# EAGLE design Forest-Joystick-Mouse-Hub (EAGLE 9.6.2)
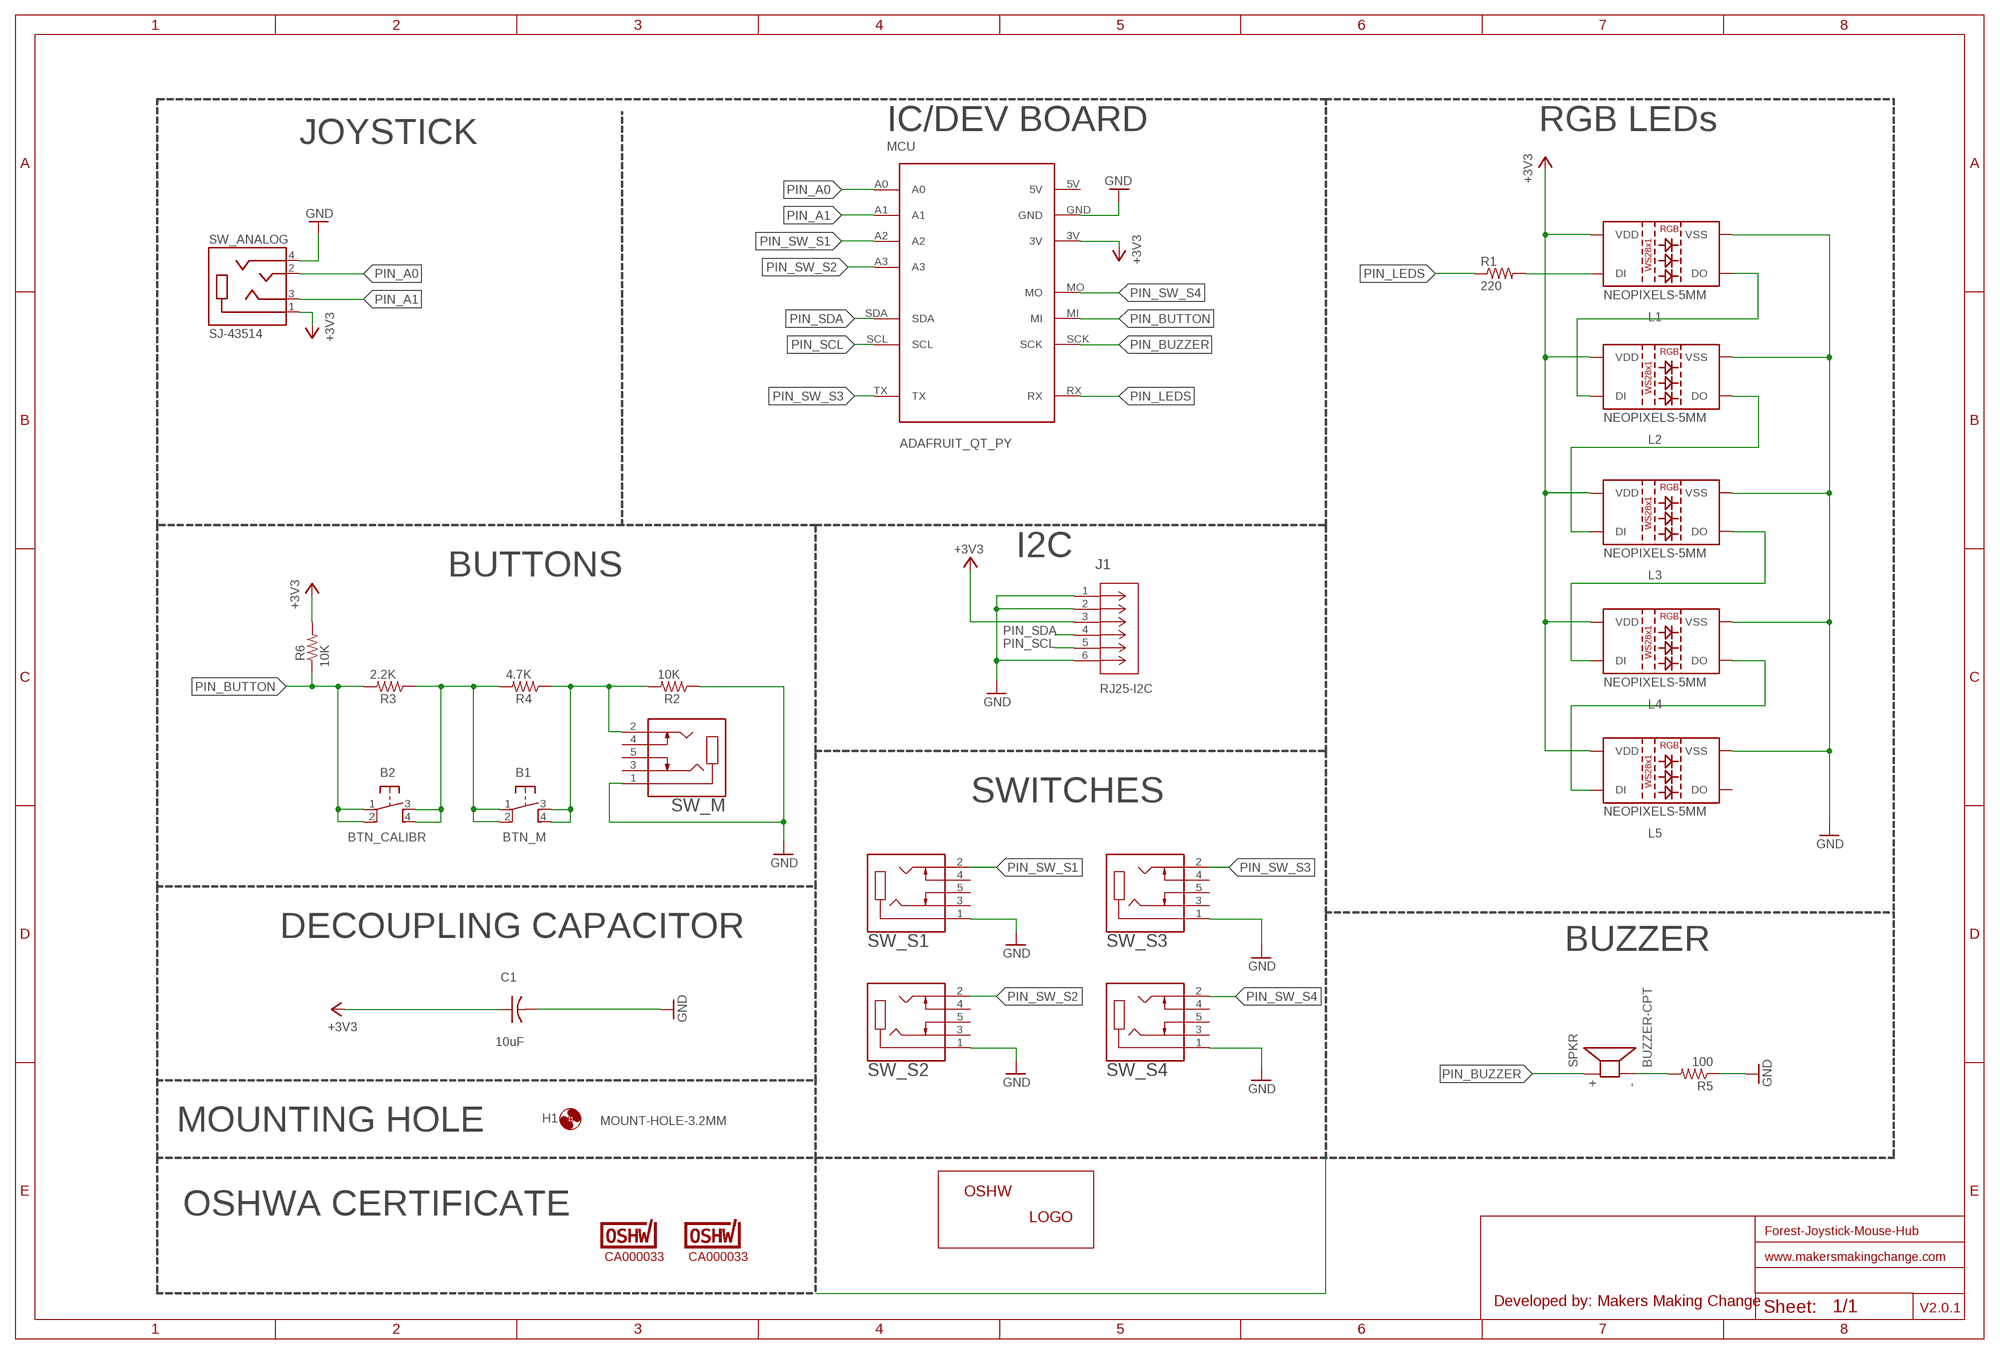
[diagram p0: schematic, sheet 1]

## Parts
B1  BTN_M  SWITCH_OMRON-PTH-12  [B3F-5050]
B2  BTN_CALIBR  SWITCH_OMRON-PTH-12  [B3F-5050]
C1  10uF  CAPACITOR-US-050-030X075  [CAP-050-030X075]
H1  MOUNT-HOLE-3.2MM  [HOLE-3.2MM]
J1  5555165-1  [CONN6_5555165-1]
L1  NEOPIXELS-5MM  [NEOPIXELS-5MM]
L2  NEOPIXELS-5MM  [NEOPIXELS-5MM]
L3  NEOPIXELS-5MM  [NEOPIXELS-5MM]
L4  NEOPIXELS-5MM  [NEOPIXELS-5MM]
L5  NEOPIXELS-5MM  [NEOPIXELS-5MM]
LOGO-OSHWA  CA000033  OSHWA-LOGO-SMALL  [OSHWA-CERT-SMALL-SILK]
MCU  ADAFRUIT_QT_PY  [QT_PY]
R1  220  RESISTOR-US-0206/8  [RESISTOR_0206/8]
R2  10K  RESISTOR-US-0206/8  [RESISTOR_0206/8]
R3  2.2K  RESISTOR-US-0206/8  [RESISTOR_0206/8]
R4  4.7K  RESISTOR-US-0206/8  [RESISTOR_0206/8]
R5  100  RESISTOR-US-0206/8  [RESISTOR_0206/8]
R6  10K  RESISTOR-US-0206/8  [RESISTOR_0206/8]
SPKR  BUZZER-CPT  [CUI_CPT-1255C-090]
SW_ANALOG  SJ-43514  [CUI_SJ-43514]
SW_M  CUI_SJ1-3535NGSJ1-3535NG  [CUI_SJ1-3535NG]
SW_S1  CUI_SJ1-3535NGSJ1-3535NG  [CUI_SJ1-3535NG]
SW_S2  CUI_SJ1-3535NGSJ1-3535NG  [CUI_SJ1-3535NG]
SW_S3  CUI_SJ1-3535NGSJ1-3535NG  [CUI_SJ1-3535NG]
SW_S4  CUI_SJ1-3535NGSJ1-3535NG  [CUI_SJ1-3535NG]
U$3  OSHW_LOGO-XSM  [OSHW_X-SMALL_LOGO]
U$4  CA000033  OSHWA-LOGO-SMALL  [OSHWA-CERT-SMALL-SILK]

## Nets
+3V3: C1.1 J1.3 L1.P2(VDD) L2.P2(VDD) L3.P2(VDD) L4.P2(VDD) L5.P2(VDD) MCU.3V R6.2 SW_ANALOG.1(SLEEVE)
GND: C1.2 J1.1 J1.2 J1.6 L1.P3(VSS) L2.P3(VSS) L3.P3(VSS) L4.P3(VSS) L5.P3(VSS) MCU.GND R2.1 R5.1 SW_ANALOG.4(RING2) SW_M.1 SW_S1.1 SW_S2.1 SW_S3.1 SW_S4.1
N$1: B1.1 B1.2 B2.3 B2.4 R3.1 R4.2
N$3: L1.P4(DO) L2.P1(DI)
N$5: B1.3 B1.4 R2.2 R4.1 SW_M.2
N$6: L2.P4(DO) L3.P1(DI)
N$7: L3.P4(DO) L4.P1(DI)
N$9: L4.P4(DO) L5.P1(DI)
N$10: L1.P1(DI) R1.2
N$12: R5.2 SPKR.N
PIN_A0: MCU.A0 SW_ANALOG.2(TIP)
PIN_A1: MCU.A1 SW_ANALOG.3(RING1)
PIN_BUTTON: B2.1 B2.2 MCU.MI R3.2 R6.1
PIN_BUZZER: MCU.SCK SPKR.P
PIN_LEDS: MCU.RX R1.1
PIN_SCL: J1.5 MCU.SCL
PIN_SDA: J1.4 MCU.SDA
PIN_SW_S1: MCU.A2 SW_S1.2
PIN_SW_S2: MCU.A3 SW_S2.2
PIN_SW_S3: MCU.TX SW_S3.2
PIN_SW_S4: MCU.MO SW_S4.2
Unconnected: L5.P4(DO) MCU.5V SW_M.3 SW_M.4 SW_M.5 SW_S1.3 SW_S1.4 SW_S1.5 SW_S2.3 SW_S2.4 SW_S2.5 SW_S3.3 SW_S3.4 SW_S3.5 SW_S4.3 SW_S4.4 SW_S4.5

## Notes on the sheet
- IC/DEV BOARD | RGB LEDs
- JOYSTICK
- I2C
- BUTTONS
- SWITCHES
- DECOUPLING CAPACITOR
- BUZZER
- MOUNTING HOLE
- OSHWA CERTIFICATE
- www.makersmakingchange.com
- Developed by: Makers Making Change
- V2.0.1

## Library data of the parts
B1 B2 = MMC Eagle:SWITCH_OMRON: OMRON SWITCH Now with beefier pads!
C1 = MMC Eagle:CAPACITOR-US-
H1 = MMC Eagle:MOUNT-HOLE-: MOUNTING HOLE with drill center marker
J1 = MMC Eagle:5555165-1; COPYRIGHT: Copyright (C) 2023 Ultra Librarian. All rights reserved.; LABEL: RJ25-I2C; MANUFACTURER_PART_NUMBER: 5555165-1; MFR_NAME: TE Connectivity
L1-L5 = MMC Eagle:NEOPIXELS-5MM: NeoPixel Diffused 5mm Through-Hole LED Addressable Lighting series 5 LED Discrete Serial (Shift Register) Red, Green, Blue (RGB) 5.00mm Dia. Options: Digikey - 1568-1213-ND <https://www.digikey.ca/en/products/detail/sparkfun-electronics/COM-12986/5673799> Mouser - 474-COM-12986 <https://www.mouser.ca/ProductDetail/SparkFun/COM-12986?qs=%2Fha2pyFadujF6KKYCR11tN6uoNPGeiRJUEZeJp5GtyQ%3D>
LOGO-OSHWA U$4 = MMC Eagle:OSHWA-LOGO
MCU = MMC Eagle:ADAFRUIT_QT_PY
R1-R6 = MMC Eagle:RESISTOR-US-: RESISTOR, American symbol
SPKR = MMC Eagle:BUZZER: Buzzer Small round buzzers that operate around the audible 2kHz range. You can use these as speakers to create simple music or user interfaces. Options: PTH - Mini Speaker - PC Mount 12mm 2.048kHz <https://www.sparkfun.com/products/7950> PTH_KIT - Mini Speaker - PC Mount 12mm 2.048kHz <https://www.sparkfun.com/products/7950> KIT simplifies soldering by adding stop mask to one side of the pads. PTH_NO_SILK - Mini Speaker - PC Mount 12mm 2.048kHz <https://www.sparkfun.com/products/7950> No silkscreen indicator of buzzer outline. PTH_KIT_NO_SILK - Mini Speaker - PC Mount 12mm 2.048kHz <https://www.sparkfun.com/products/7950> KIT package w/o silkscreen SMD - Buzzer Audio Magnetic (CCV-084B16) SMD buzzer used on, e.g. the LilyPad Buzzer <https://www.sparkfun.com/products/8463> and RFID USB Reader <https://www.sparkfun.com/products/9963>. SMD_KIT - Buzzer Audio Magnetic (CCV-084B16) SMD Buzzer with elongated pins to make soldering easier. Used on the SparkFun Simon Says - Surface Mount Soldering Kit <https://www.sparkfun.com/products/10935>.
SW_ANALOG = MMC Eagle:SJ-43514: SJ-43514 3.50mm (0.141", 1/8", Mini Plug) - Headphone Phone Jack Stereo (4 Conductor, TRRS) Connector. You can use these as jacks to connect analog joysticks or create simple switch interfaces. Options: Digikey - CP-43514-ND <https://www.digikey.ca/en/products/detail/cui-devices/SJ-43514/368146> Mouser - 490-SJ-43514 <https://www.mouser.ca/ProductDetail/CUI-Devices/SJ-43514?qs=WyjlAZoYn51bsBOfuwwiuw%3D%3D>
SW_M SW_S1-SW_S4 = MMC Eagle:CUI_SJ1-3535NG: SJ1-3535NG 3.50mm (0.141", 1/8", Mini Plug) - Headphone Phone Jack Stereo (3 Conductor, TRS) Connector. You can use these as jacks to create simple switch interfaces. Options: Digikey - CP1-3535NG-ND <https://www.digikey.ca/en/products/detail/cui-devices/SJ1-3535NG/738699> Mouser - 490-SJ1-3535NG <https://www.mouser.ca/ProductDetail/CUI-Devices/SJ1-3535NG?qs=WyjlAZoYn50jUmKVsqeRJw%3D%3D>
U$3 = MMC Eagle:OSHW_LOGO-

## Net classes
0 GND: clearance 0.205 mm
2 GND2: clearance 0.205 mm to class 0, clearance 0.205 mm to class 1, clearance 0.205 mm
3 GND3: clearance 0.205 mm to class 0, clearance 0.205 mm to class 1, clearance 0.205 mm to class 2, clearance 0.205 mm

## Board
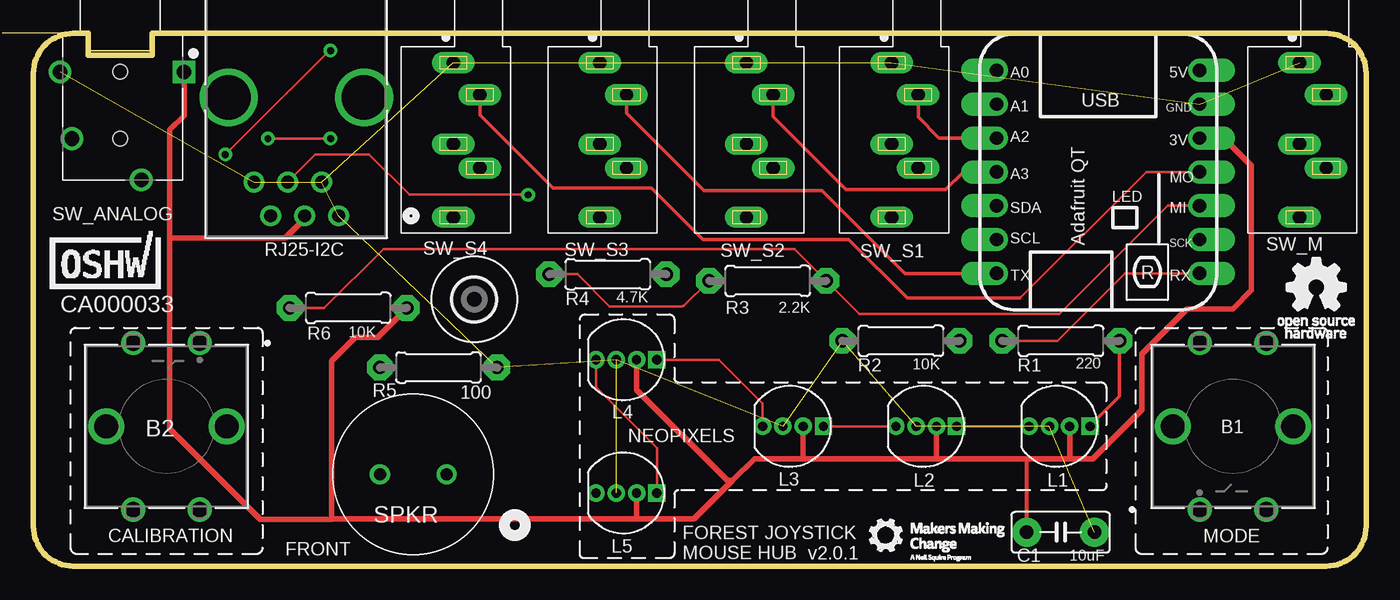
[diagram p1: board, top side]
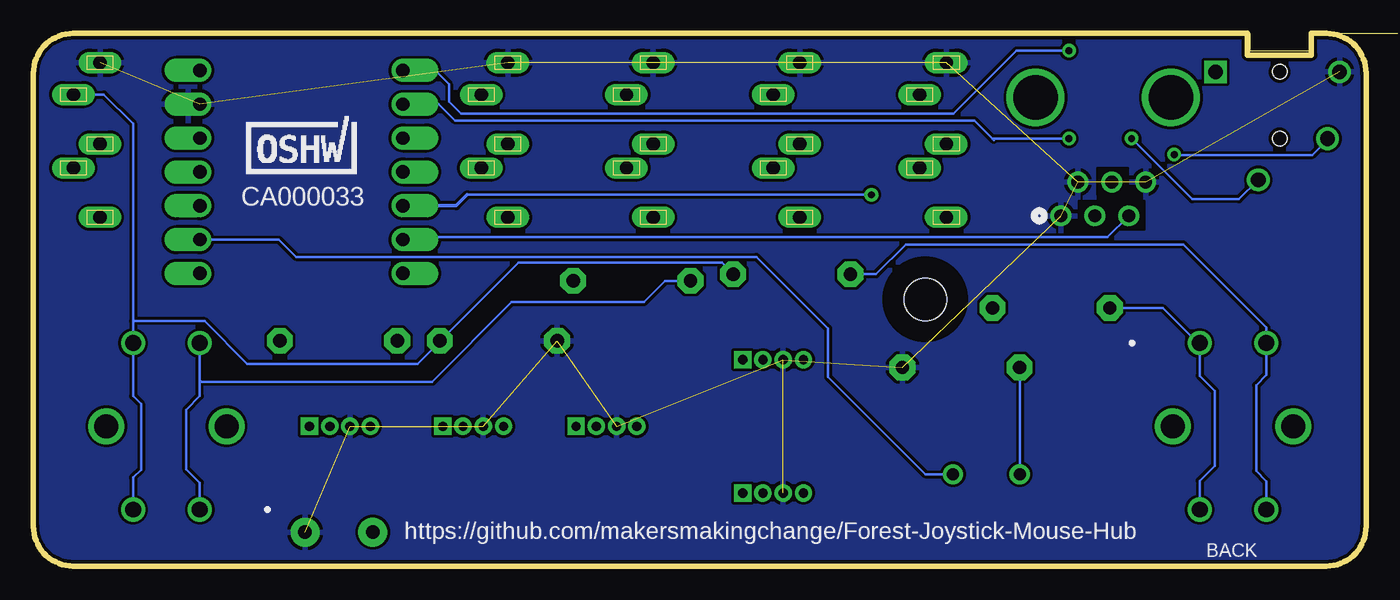
[diagram p2: board, bottom side, seen from below]

Size 100 x 40 mm. Coordinates in mm from the lower left corner, seen from the top.
Outline: 97,40 8.9,40 8.9,38.36 4.1,38.36 4.1,40 3,40 arc90 0,37 0,3 arc90 3,0 97,0 arc90 100,3 100,37 arc90 97,40
Copper layers (1*16): Top 0.035mm / dielectric 1.5mm / Bottom 0.035mm
Design rules "SparkFun": minimum track width 8mil, minimum drill 20mil, track to track 8mil, track to pad 8mil, pad to pad 8mil, via to via 8mil, smd to smd 8mil, copper to edge 10mil, drill to drill 8mil, minimum pad ring 12mil, minimum via ring 10mil, stop-mask expansion 4mil, vias tented up to drill 25mil, thermal gap 10mil

### Footprints (pad centres in the part's own frame; a part is rotated, then mirrored left to right if it is on the bottom)
B3F-5050 = drill 1.194 pad 1.702: 1 -6.248,2.489; 2 6.248,2.489; 3 -6.248,-2.515; 4 6.248,-2.515 | drill 1.803 pad 1.803: 5 0,4.496; 6 0,-4.521
CAP-050-030X075 = drill 1.016 pad 2.184: 1 -2.54,0; 2 2.54,0
HOLE-3.2MM = hole 3.2: 0,0
CONN6_5555165-1 = drill 0.965 pad 1.473: 1 0,0; 2 1.27,-2.54; 3 2.54,0; 4 3.81,-2.54; 5 5.08,0; 6 6.35,-2.54 | drill 3.327 pad 3.327: 7 -1.905,-8.89; 8 8.255,-8.89
NEOPIXELS-5MM = drill 0.7 pad 1.016 square: P1 2.28,0 | drill 0.7 pad 1.016: P2 0.76,0; P3 -0.76,0; P4 -2.28,0
QT_PY = drill 1 pad 1.778 offset: 3V 16.51,12.887; 5V 16.51,17.967; A0 1.27,17.967; A1 1.27,15.427; A2 1.27,12.887; A3 1.27,10.347; GND 16.51,15.427; MI 16.51,7.807; MO 16.51,10.347; RX 16.51,2.727; SCK 16.51,5.267; SCL 1.27,5.267; SDA 1.27,7.807; TX 1.27,2.727
RESISTOR_0206/8 = drill 1 pad 1.93 octagon: 1 -4.4,0; 2 4.4,0
CUI_CPT-1255C-090 = drill 0.9: N 2.5,0; P -2.5,0
CUI_SJ-43514 = drill 1.1 square: 1 -2.6,4.8 | drill 1.1: 2 2.4,-3.6; 3 5.5,1.6; 4 -2.6,-4.5 | hole 1.1: -2.6,0; 2.4,0
CUI_SJ1-3535NG = drill 1 long: 1 0,0; 2 2.4,2; 3 7.9,2; 4 11.6,0; 5 6.1,0

### Placement (x,y rotation side)
B1  90,10.5 90 top
B2  10,10.5 270 top
C1  77.08,2.55 0 top
H1  33.08,20.02 180 top
J1  22.9,26.3 180 top
L1  77,10.5 0 top
L2  67,10.5 0 top
L3  57,10.5 0 top
L4  44.5,15.5 0 top
L5  44.5,5.5 0 top
LOGO-OSHWA  79.88,29.44 0 bottom
MCU  71,19.25 0 top
R1  77.1,16.92 0 top
R2  65.1,16.92 0 top
R3  55.1,21.42 0 top
R4  43.1,21.92 180 top
R5  30.4,14.92 180 top
R6  23.63,19.39 0 top
SPKR  28.5,6.9 180 top
SW_ANALOG  6.5,34.5 270 top
SW_M  95,37.8 270 top
SW_S1  64.4,37.8 270 top
SW_S2  53.5,37.8 270 top
SW_S3  42.5,37.8 270 top
SW_S4  31.5,37.8 270 top
U$3  96.2,20.1 0 top
U$4  5.4,20.8 0 top
U$5  [MMC_X-SMALL_LOGO]  67.7,0.4 0 top

### Tracks (layer width: path | path; a pad name or v marks a point on that pad's centre or on a via)
+3V3
  Top 0.203: 74.53,8.04 74.5,8.07
  Top 0.305: C1.1 74.53,6.46 74.53,8.04
  Top 0.406: SW_ANALOG.1 11.3,33.83 10.24,32.76 10.24,24.64 | L2.P2 67.76,8.07 | 67.76,8.07 74.5,8.07 77.6,8.07 | L3.P2 57.76,8.07 | 57.76,8.07 67.76,8.07 | 57.76,8.07 54.1,8.07 52.46,6.44 | 52.46,6.44 49.56,3.54 45.26,3.54 | 45.26,3.54 22.38,3.54 | 52.46,6.44 52.06,6.44 45.26,13.24 L4.P2 | MCU.3V 89.31,32.14 91.38,30.07 91.38,20.73 89.97,19.32 86.53,19.32 83.15,15.95 83.15,11.75 79.47,8.07 77.6,8.07 | L1.P2 77.76,8.23 77.6,8.07 | 10.24,24.64 18.91,24.64 20.36,26.09 J1.3 | 10.24,24.64 10.24,10.31 17.01,3.54 22.38,3.54 | R6.2 25.82,17.19 24.14,17.19 22.38,15.42 22.38,3.54 | L5.P2 45.26,3.54 | 45.26,3.54
GND  (17 unrouted)
  pour Bottom: 96,40 3,40 arc90 0,37 0,3 arc90 3,0 97,0 arc90 100,3 100,37 arc90
  cutout Bottom: 20.18,27.89 17.9,27.89 17.9,29.9 20.18,29.9
  cutout Bottom: 21.57,25.26 16.65,25.26 16.65,27.39 21.57,27.39
N$1
  Top 0.203: R3.1 48.8,19.52 48.7,19.52 48.68,19.5 43.23,19.5 40.82,21.92 R4.2
  Bottom 0.203: R4.2 36.78,21.92 34.54,24.16 13.73,24.16 7.49,17.91 B2.3 7.49,14.34 8.25,13.57 8.25,7.15 7.49,6.38 B2.4 | B1.1 87.51,6.26 88.53,7.28 88.53,11.75 87.51,12.76 87.51,14 | 87.51,14 B1.2 | R3.1 52.6,21.42 54.2,19.82 64.11,19.82 70.08,13.85 87.36,13.85 87.51,14
N$3
  Top 0.203: L1.P4 L2.P1
N$5
  Bottom 0.203: B1.3 92.52,6.66 91.92,7.25 91.92,12.18 92.52,12.77 B1.4 92.52,18.4 | SW_M.2 94.7,35.4 92.52,33.22 92.52,18.4 | 92.52,18.4 87.15,18.4 83.95,15.2 71.17,15.2 69.5,16.88 R2.2 69.48,16.92 63.6,22.8 48.35,22.8 47.5,21.95 R4.1
N$6
  Top 0.203: L2.P4 L3.P1
N$7
  Top 0.203: L3.P4 54.72,12.23 51.45,15.5 L4.P1
N$9
  Top 0.203: L4.P4 42.22,13.46 46.78,8.89 L5.P1
N$10
  Top 0.254: L1.P1 79.28,10.54 81.49,12.75 81.5,13.1 R1.2
N$12
  Bottom 0.203: R5.2 SPKR.N
PIN_A0  (via drill 0.51)
  Top 0.203: v22.3,38.7 22.2,38.7 v14.4,30.9
  Bottom 0.203: MCU.A0 69.85,37.22 68.81,36.18 68.81,34.87 67.9,33.95 30.98,33.95 26.23,38.7 v22.3,38.7 | SW_ANALOG.2 2.9,32 4.04,30.86 14.36,30.86 v14.4,30.9
PIN_A1  (via drill 0.51)
  Top 0.203: v17.6,32.1 v22.3,32.1
  Bottom 0.203: SW_ANALOG.3 9.55,27.55 13.05,27.55 v17.6,32.1 | MCU.A1 69.58,34.68 68.35,33.45 29.4,33.45 28.05,32.1 | 27.95,32 28.05,32.1 | v22.3,32.1 28.05,32.1
PIN_BUTTON
  Top 0.203: MCU.MI 85.11,27.06 76.97,18.92 62,18.92 R3.2 57.09,23.82 26.27,23.82 21.84,19.39 R6.1
  Bottom 0.203: R6.1 19.21,19.38 15.27,19.38 12.64,16.75 B2.1 12.49,14.29 11.35,13.15 11.35,7.55 12.49,6.41 B2.2
PIN_BUZZER
  Bottom 0.203: MCU.SCK 81.59,24.52 80.3,23.23 45.75,23.23 40.38,17.85 40.38,14.19 33.08,6.9 SPKR.P
PIN_LEDS
  Top 0.203: R1.1 76.84,16.92 81.9,21.98 MCU.RX
PIN_SCL
  Bottom 0.203: MCU.SCL 72.07,24.72 19.4,24.72 J1.5
PIN_SDA  (via drill 0.51)
  Top 0.203: v37.12,27.88 28.22,27.88 25.2,30.9 21.15,30.9 J1.4
  Bottom 0.203: 67.44,27.88 v37.12,27.88
  Bottom 0.254: MCU.SDA 68.27,27.06 67.44,27.88
PIN_SW_S1
  Top 0.203: 66.4,33.7 66.4,33.71
  Top 0.254: SW_S1.2 66.4,33.71 | MCU.A2 67.96,32.14 66.4,33.7
PIN_SW_S2
  Top 0.254: MCU.A3 69.76,29.6 68.45,28.28 60.95,28.28 55.5,33.73 SW_S2.2
PIN_SW_S3
  Top 0.254: MCU.TX 65.39,21.98 59.16,28.21 50.3,28.21 44.5,34.02 SW_S3.2
PIN_SW_S4
  Top 0.203: MCU.MO 83.5,29.6 74.03,20.12
  Top 0.254: 74.03,20.12 65.56,20.12 61.16,24.52 50.23,24.52 46.38,28.38 38.98,28.38 33.5,33.85 SW_S4.2

### Text on the board
tPlace: NEOPIXELS | MODE | CALIBRATION | FRONT | FOREST JOYSTICK / MOUSE HUB
bPlace: https://github.com/makersmakingchange/Forest-Joystick-Mouse-Hub | BACK
tNames: v2.0.1